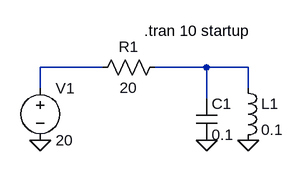
[diagram p0: schematic TVNL-Test-Oscillation.asc]
TVNL-Test-Oscillation.asc, the LTspice schematic file:
Version 4
SHEET 1 880 680
WIRE 112 144 16 144
WIRE 272 144 192 144
WIRE 336 144 272 144
WIRE 16 176 16 144
WIRE 336 176 336 144
WIRE 272 192 272 144
FLAG 16 256 0
FLAG 272 256 0
FLAG 336 256 0
SYMBOL voltage 16 160 R0
WINDOW 123 0 0 Left 0
WINDOW 39 0 0 Left 0
SYMATTR InstName V1
SYMATTR Value 20
SYMBOL res 208 128 R90
WINDOW 0 0 56 VBottom 2
WINDOW 3 32 56 VTop 2
SYMATTR InstName R1
SYMATTR Value 20
SYMBOL cap 256 192 R0
SYMATTR InstName C1
SYMATTR Value 0.1
SYMBOL ind 320 160 R0
SYMATTR InstName L1
SYMATTR Value 0.1
TEXT 176 88 Left 2 !.tran 10 startup

The netlist it stands for:
* TVNL-Test-Oscillation.asc
V1 N001 0 20
R1 N002 N001 20
C1 N002 0 0.1
L1 N002 0 0.1
.tran 10 startup
.backanno
.end